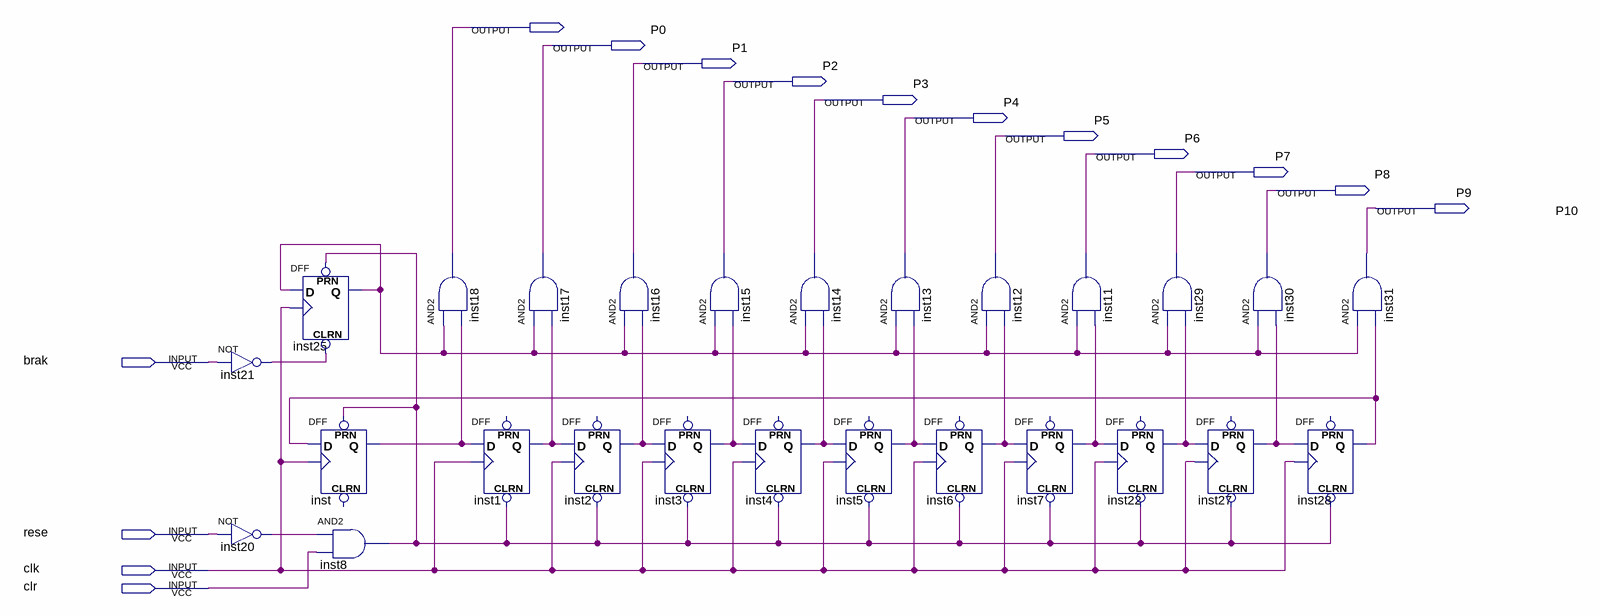
[diagram p0: schematic sheet]
// Quartus schematic JPQ.bdf as structural Verilog: 26 symbols, 15 pins
module JPQ (
  input  brak,
  input  rese,
  input  clk,
  input  clr,
  output P0,
  output P1,
  output P2,
  output P3,
  output P4,
  output P5,
  output P6,
  output P7,
  output P8,
  output P9,
  output P10
);

  wire inst1_q, inst2_q, inst3_q, inst4_q, inst5_q, inst6_q, inst7_q, inst8_out, inst20_out, inst21_out,
       inst22_q, inst25_q, inst27_q, inst28_q, inst_q;

  not inst21 (inst21_out, brak);
  not inst20 (inst20_out, rese);
  DFF inst25 (.CLRN(inst21_out), .CLK(clk), .D(inst25_q), .PRN(inst8_out), .Q(inst25_q));
  DFF inst (.CLK(clk), .D(inst28_q), .PRN(inst8_out), .Q(inst_q));  // open: CLRN
  and inst8 (inst8_out, inst20_out, clr);
  and inst18 (P0, inst25_q, inst_q);
  DFF inst1 (.CLRN(inst8_out), .CLK(clk), .D(inst_q), .Q(inst1_q));  // open: PRN
  and inst17 (P1, inst25_q, inst1_q);
  DFF inst2 (.CLRN(inst8_out), .CLK(clk), .D(inst1_q), .Q(inst2_q));  // open: PRN
  and inst16 (P2, inst25_q, inst2_q);
  DFF inst3 (.CLRN(inst8_out), .CLK(clk), .D(inst2_q), .Q(inst3_q));  // open: PRN
  and inst15 (P3, inst25_q, inst3_q);
  and inst14 (P4, inst25_q, inst4_q);
  DFF inst4 (.CLRN(inst8_out), .CLK(clk), .D(inst3_q), .Q(inst4_q));  // open: PRN
  DFF inst5 (.CLRN(inst8_out), .CLK(clk), .D(inst4_q), .Q(inst5_q));  // open: PRN
  and inst13 (P5, inst25_q, inst5_q);
  DFF inst6 (.CLRN(inst8_out), .CLK(clk), .D(inst5_q), .Q(inst6_q));  // open: PRN
  and inst12 (P6, inst25_q, inst6_q);
  DFF inst7 (.CLRN(inst8_out), .CLK(clk), .D(inst6_q), .Q(inst7_q));  // open: PRN
  and inst11 (P7, inst25_q, inst7_q);
  and inst29 (P8, inst25_q, inst22_q);
  DFF inst22 (.CLRN(inst8_out), .CLK(clk), .D(inst7_q), .Q(inst22_q));  // open: PRN
  DFF inst27 (.CLRN(inst8_out), .CLK(clk), .D(inst22_q), .Q(inst27_q));  // open: PRN
  and inst30 (P9, inst25_q, inst27_q);
  DFF inst28 (.CLRN(inst8_out), .CLK(clk), .D(inst27_q), .Q(inst28_q));  // open: PRN
  and inst31 (P10, inst25_q, inst28_q);
endmodule
